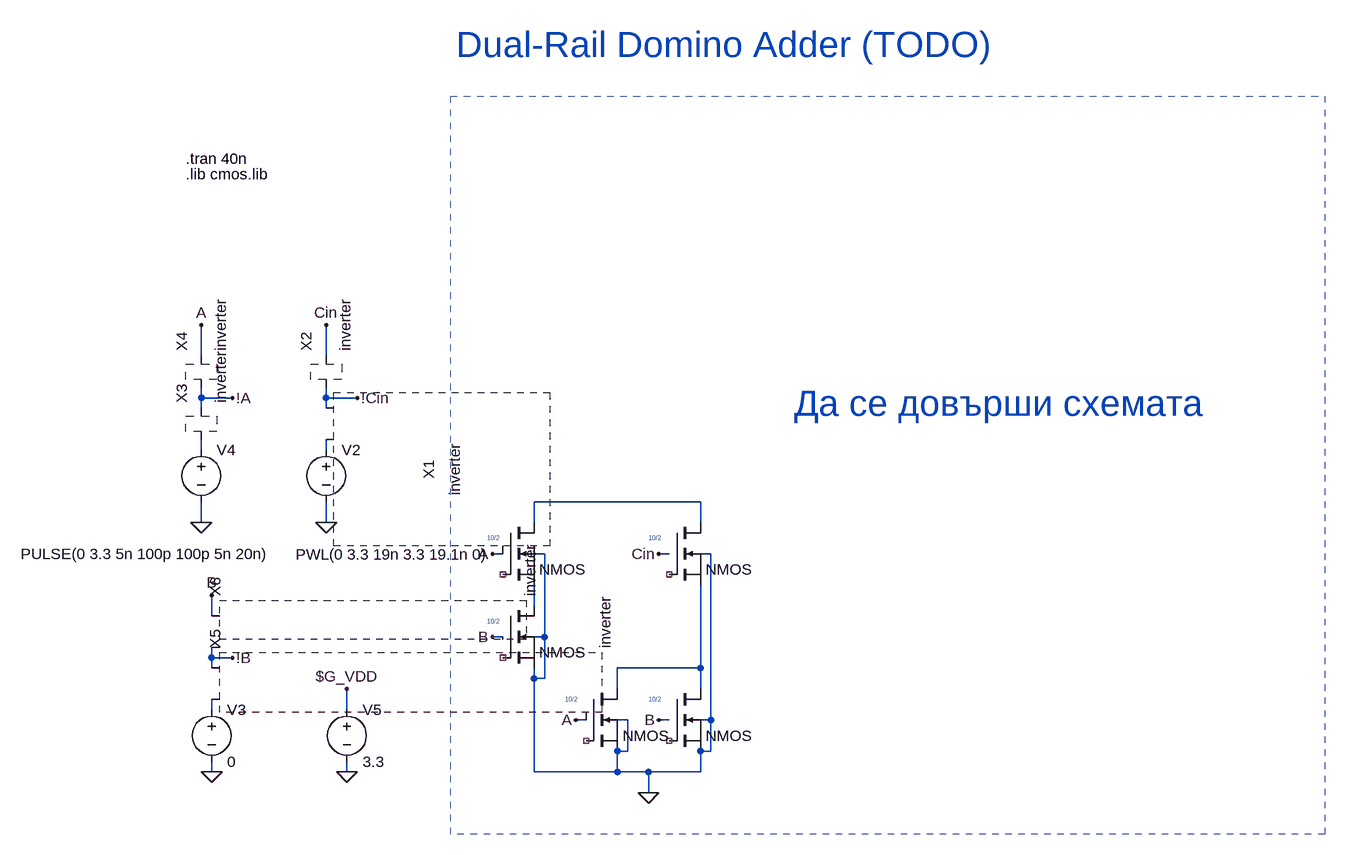
[diagram p0: schematic adder-dual-rail-domino.asc]
adder-dual-rail-domino.asc, the LTspice schematic file:
Version 4
SHEET 1 1140 1464
WIRE -592 64 -592 16
WIRE -400 64 -400 16
WIRE -592 128 -592 112
WIRE -544 128 -592 128
WIRE -400 128 -400 112
WIRE -352 128 -400 128
WIRE -592 144 -592 128
WIRE -400 144 -400 128
WIRE -592 208 -592 192
WIRE -400 208 -400 192
WIRE 176 288 -80 288
WIRE -592 320 -592 288
WIRE -400 320 -400 288
WIRE -80 320 -80 288
WIRE 176 320 176 288
WIRE -128 368 -144 368
WIRE -64 368 -80 368
WIRE 128 368 112 368
WIRE 192 368 176 368
WIRE -80 448 -80 416
WIRE -576 464 -576 432
WIRE -128 496 -144 496
WIRE -64 496 -64 368
WIRE -64 496 -80 496
WIRE -576 528 -576 512
WIRE -544 528 -576 528
WIRE -576 544 -576 528
WIRE 176 544 176 416
WIRE 176 544 48 544
WIRE -80 560 -80 544
WIRE -64 560 -64 496
WIRE -64 560 -80 560
WIRE 48 576 48 544
WIRE 176 576 176 544
WIRE -576 608 -576 592
WIRE -368 608 -368 576
WIRE 0 624 -16 624
WIRE 64 624 48 624
WIRE 128 624 112 624
WIRE 192 624 192 368
WIRE 192 624 176 624
WIRE 64 672 64 624
WIRE 64 672 48 672
WIRE 192 672 192 624
WIRE 192 672 176 672
WIRE -576 704 -576 688
WIRE -368 704 -368 688
WIRE -80 704 -80 560
WIRE 48 704 48 672
WIRE 48 704 -80 704
WIRE 96 704 48 704
WIRE 176 704 176 672
WIRE 176 704 96 704
WIRE 96 736 96 704
FLAG -368 576 $G_VDD
FLAG -368 704 0
FLAG -400 320 0
FLAG -576 704 0
FLAG -592 320 0
FLAG -144 368 A
FLAG -144 496 B
FLAG 112 368 Cin
FLAG -16 624 A
FLAG 112 624 B
FLAG 96 736 0
FLAG -592 16 A
FLAG -400 16 Cin
FLAG -576 432 B
FLAG -544 128 !A
FLAG -352 128 !Cin
FLAG -544 528 !B
SYMBOL voltage -368 592 R0
WINDOW 123 0 0 Left 0
WINDOW 39 0 0 Left 0
SYMATTR InstName V5
SYMATTR Value 3.3
SYMBOL voltage -400 192 R0
WINDOW 123 0 0 Left 0
WINDOW 39 0 0 Left 0
WINDOW 3 -47 177 Left 2
SYMATTR Value PWL(0 3.3 19n 3.3 19.1n 0)
SYMATTR InstName V2
SYMBOL voltage -576 592 R0
WINDOW 123 0 0 Left 0
WINDOW 39 0 0 Left 0
SYMATTR InstName V3
SYMATTR Value 0
SYMBOL voltage -592 192 R0
WINDOW 3 107 176 Right 2
WINDOW 123 0 0 Left 0
WINDOW 39 0 0 Left 0
SYMATTR Value PULSE(0 3.3 5n 100p 100p 5n 20n)
SYMATTR InstName V4
SYMBOL NMOS -128 320 R0
WINDOW 0 56 32 Invisible 0
SYMATTR InstName M17
SYMATTR Value NMOS
SYMATTR Value2 l=0.6u w=3u
SYMBOL NMOS -128 448 R0
WINDOW 0 56 32 Invisible 0
SYMATTR InstName M19
SYMATTR Value NMOS
SYMATTR Value2 l=0.6u w=3u
SYMBOL NMOS 0 576 R0
WINDOW 0 56 32 Invisible 0
SYMATTR InstName M21
SYMATTR Value NMOS
SYMATTR Value2 l=0.6u w=3u
SYMBOL NMOS 128 576 R0
WINDOW 0 56 32 Invisible 0
SYMATTR InstName M22
SYMATTR Value NMOS
SYMATTR Value2 l=0.6u w=3u
SYMBOL NMOS 128 320 R0
WINDOW 0 56 32 Invisible 0
SYMATTR InstName M24
SYMATTR Value NMOS
SYMATTR Value2 l=0.6u w=3u
SYMBOL inverter -592 176 R270
SYMATTR InstName X3
SYMBOL inverter -592 96 R270
SYMATTR InstName X4
SYMBOL inverter -400 176 R270
SYMATTR InstName X1
SYMBOL inverter -400 96 R270
SYMATTR InstName X2
SYMBOL inverter -576 576 R270
SYMATTR InstName X5
SYMBOL inverter -576 496 R270
SYMATTR InstName X6
TEXT -616 -216 Left 2 !.lib cmos.lib
TEXT -616 -240 Left 2 !.tran 40n
TEXT 96 344 Left 0 ;10/2
TEXT -32 592 Left 0 ;10/2
TEXT 96 592 Left 0 ;10/2
TEXT -152 344 Left 0 ;10/2
TEXT -152 472 Left 0 ;10/2
TEXT -200 -416 Left 5 ;Dual-Rail Domino Adder (TODO)
TEXT 320 136 Left 5 ;Да се довърши схемата
RECTANGLE Normal 1136 800 -208 -336 2

The netlist it stands for:
* adder-dual-rail-domino.asc
V5 $G_VDD 0 3.3
V2 N002 0 PWL(0 3.3 19n 3.3 19.1n 0)
V3 N006 0 0
V4 N001 0 PULSE(0 3.3 5n 100p 100p 5n 20n)
M17 N003 NC_01 N004 N004 NMOS l=0.6u w=3u
M19 N004 NC_02 0 0 NMOS l=0.6u w=3u
* M21: NMOS l=0.6u w=3u (symbol NMOS not certain, pin order unknown); nets seen at it: 0, N005
* M22: NMOS l=0.6u w=3u (symbol NMOS not certain, pin order unknown); nets seen at it: 0, N005
* M24: NMOS l=0.6u w=3u (symbol NMOS not certain, pin order unknown); nets seen at it: N003, N005
* X3: inverter (symbol inverter not available, pin order unknown); nets seen at it: !A, N001
* X4: inverter (symbol inverter not available, pin order unknown); nets seen at it: !A, A
* X1: inverter (symbol inverter not available, pin order unknown); nets seen at it: !Cin, 0, A, N002
* X2: inverter (symbol inverter not available, pin order unknown); nets seen at it: !Cin, Cin
* X5: inverter (symbol inverter not available, pin order unknown); nets seen at it: !B, A, N006
* X6: inverter (symbol inverter not available, pin order unknown); nets seen at it: !B, 0, B
.model NMOS NMOS
.model PMOS PMOS
.lib standard.mos
.lib cmos.lib
.tran 40n
* 10/2
* 10/2
* 10/2
* 10/2
* 10/2
* Dual-Rail Domino Adder (TODO)
* Да се довърши схемата
.backanno
.end